# EAGLE design ATX12V_MAIN_VERT (EAGLE 7.1.0)
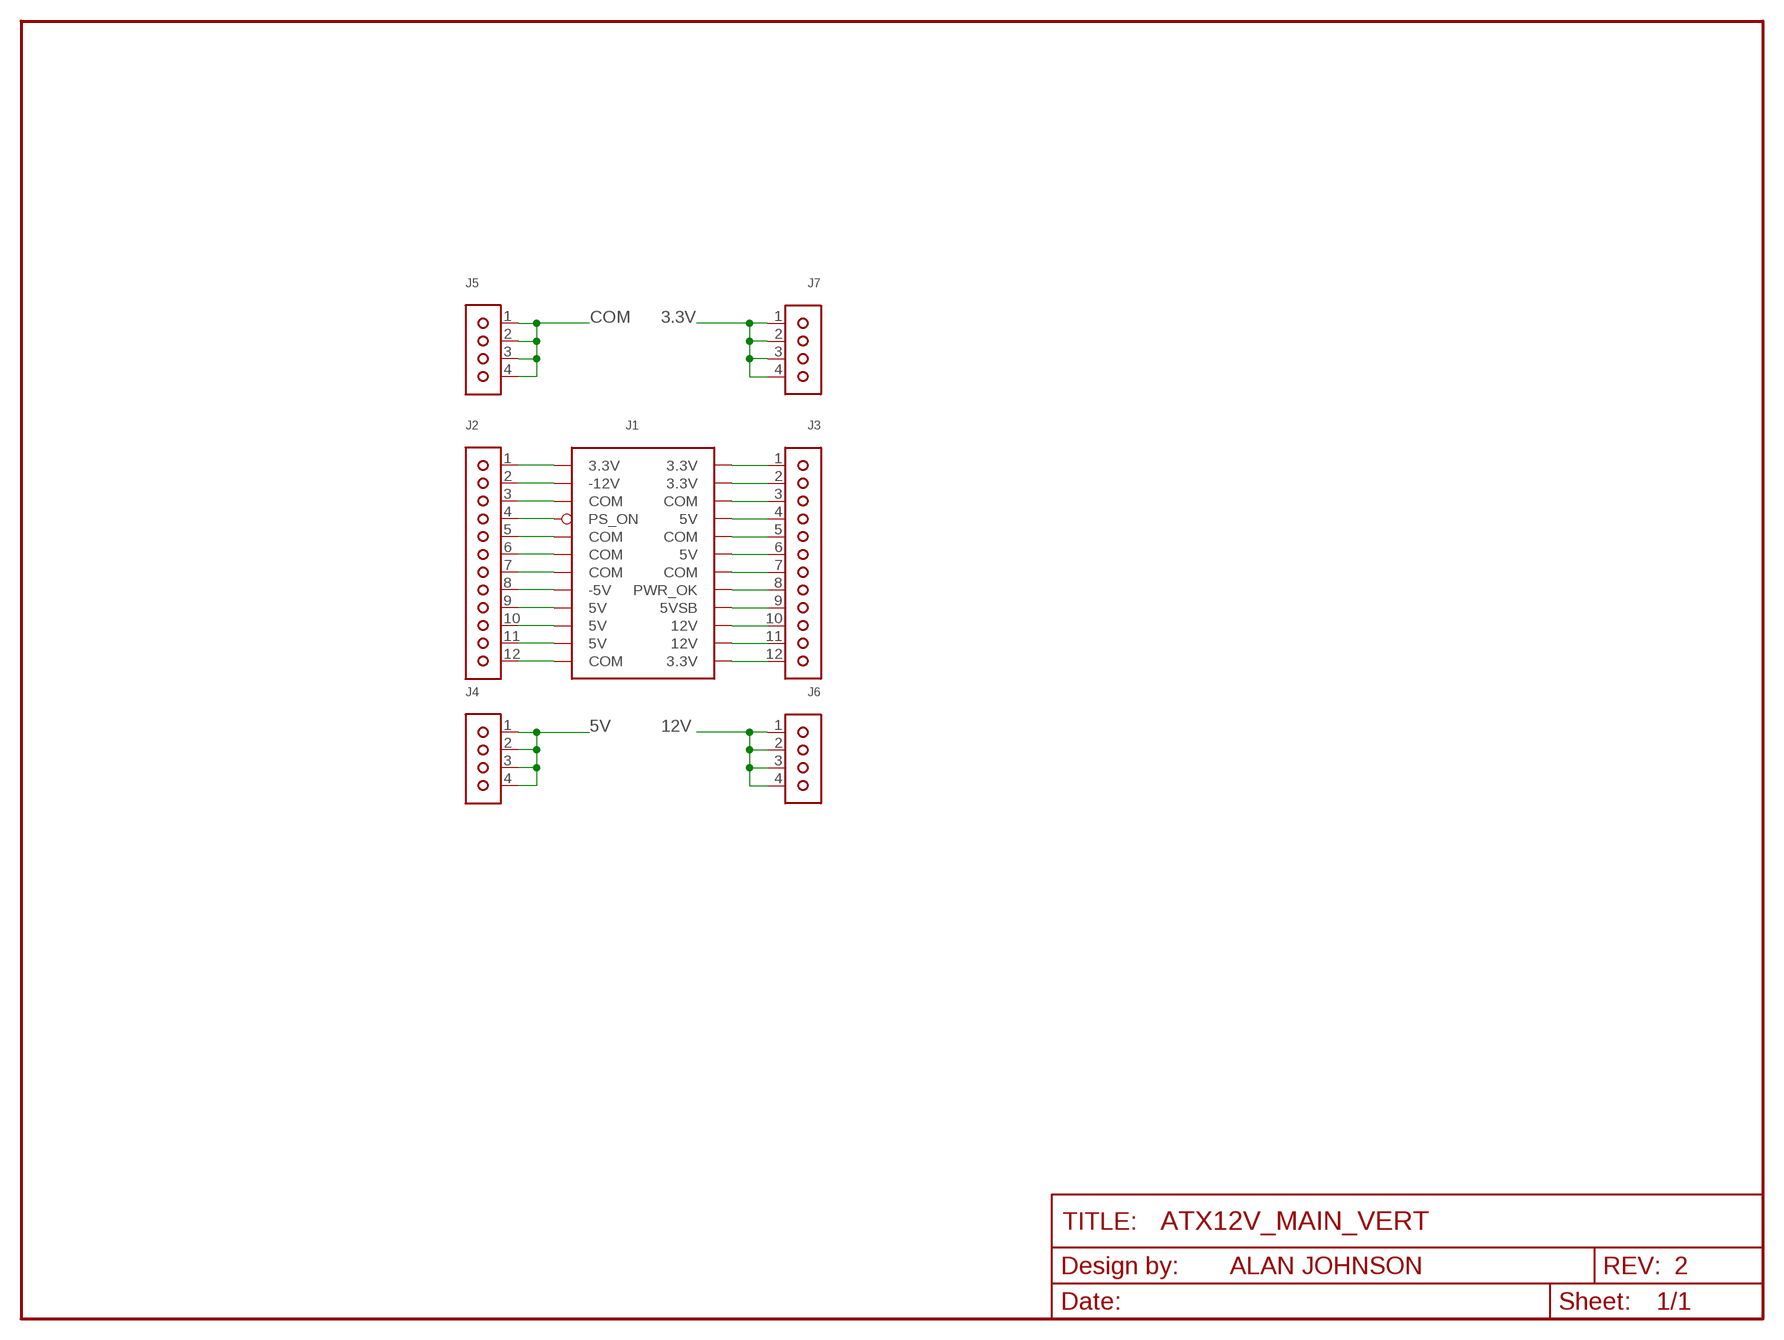
[diagram p0: schematic, sheet 1]

## Parts
J1  ATX12V_MAIN_VERT  [44206-0007]
J2  1X12  [1X12]
J3  1X12  [1X12]
J4  1X04  [1X04]
J5  1X04  [1X04]
J6  1X04  [1X04]
J7  1X04  [1X04]

## Nets
3.3V: J1.1(3.3V) J1.2(3.3V) J1.12(3.3V) J1.13(3.3V) J2.1 J3.1 J3.2 J3.12 J7.1 J7.2 J7.3 J7.4
5V: J1.4(5V) J1.6(5V) J1.21(5V) J1.22(5V) J1.23(5V) J2.9 J2.10 J2.11 J3.4 J3.6 J4.1 J4.2 J4.3 J4.4
5VSB: J1.9(5VSB) J3.9
12V: J1.10(12V) J1.11(12V) J3.10 J3.11 J6.1 J6.2 J6.3 J6.4
-5V: J1.20(-5V) J2.8
-12V: J1.14(-12V) J2.2
COM: J1.3(COM) J1.5(COM) J1.7(COM) J1.15(COM) J1.17(COM) J1.18(COM) J1.19(COM) J1.24(COM) J2.3 J2.5 J2.6 J2.7 J2.12 J3.3 J3.5 J3.7 J5.1 J5.2 J5.3 J5.4
PS_ON: J1.16(PS_ON) J2.4
PWR_OK: J1.8(PWR_OK) J3.8

## Notes on the sheet
- ALAN JOHNSON | 2

## Library data of the parts
J1 = breakouts:ATX12V_MAIN: ATX12V Main Connector
J2 J3 = breakouts:1X12: 1x12 Pin Headers
J4-J7 = breakouts:1X04: 1x04 Pin Headers

## Board
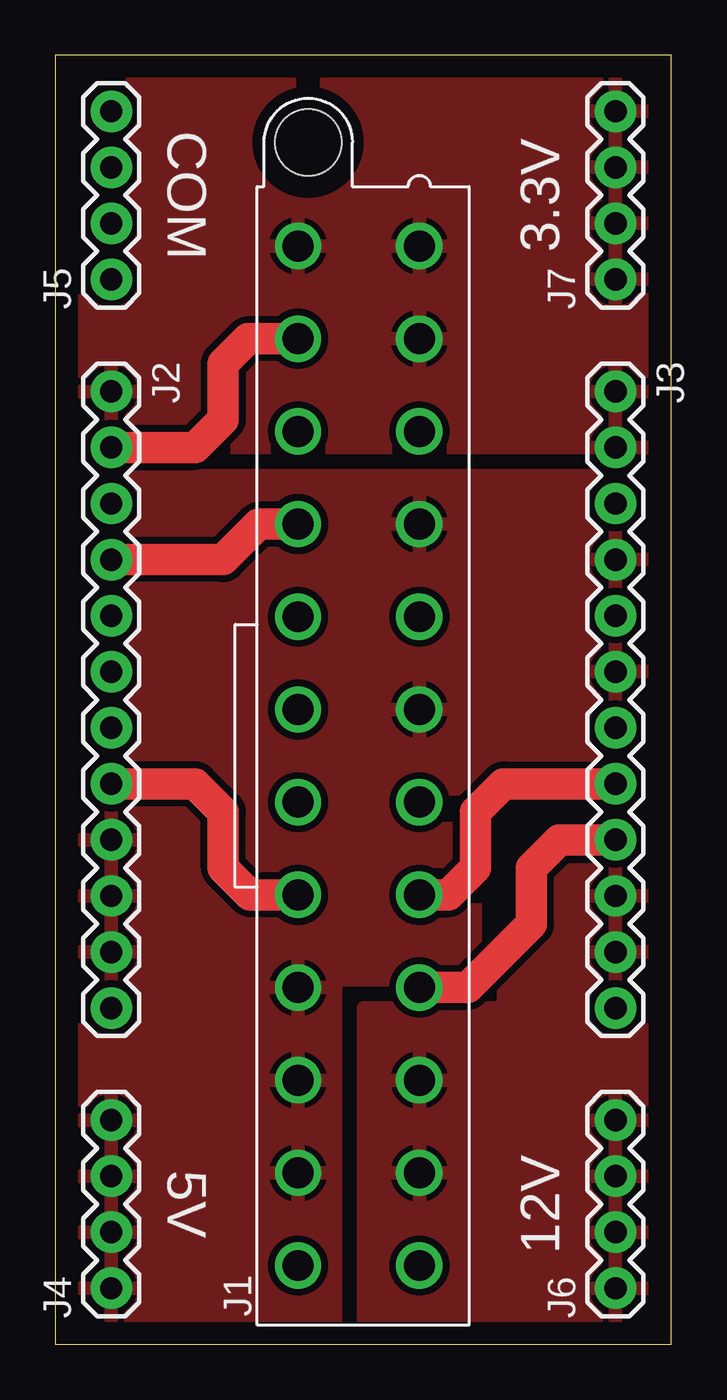
[diagram p1: board, top side]
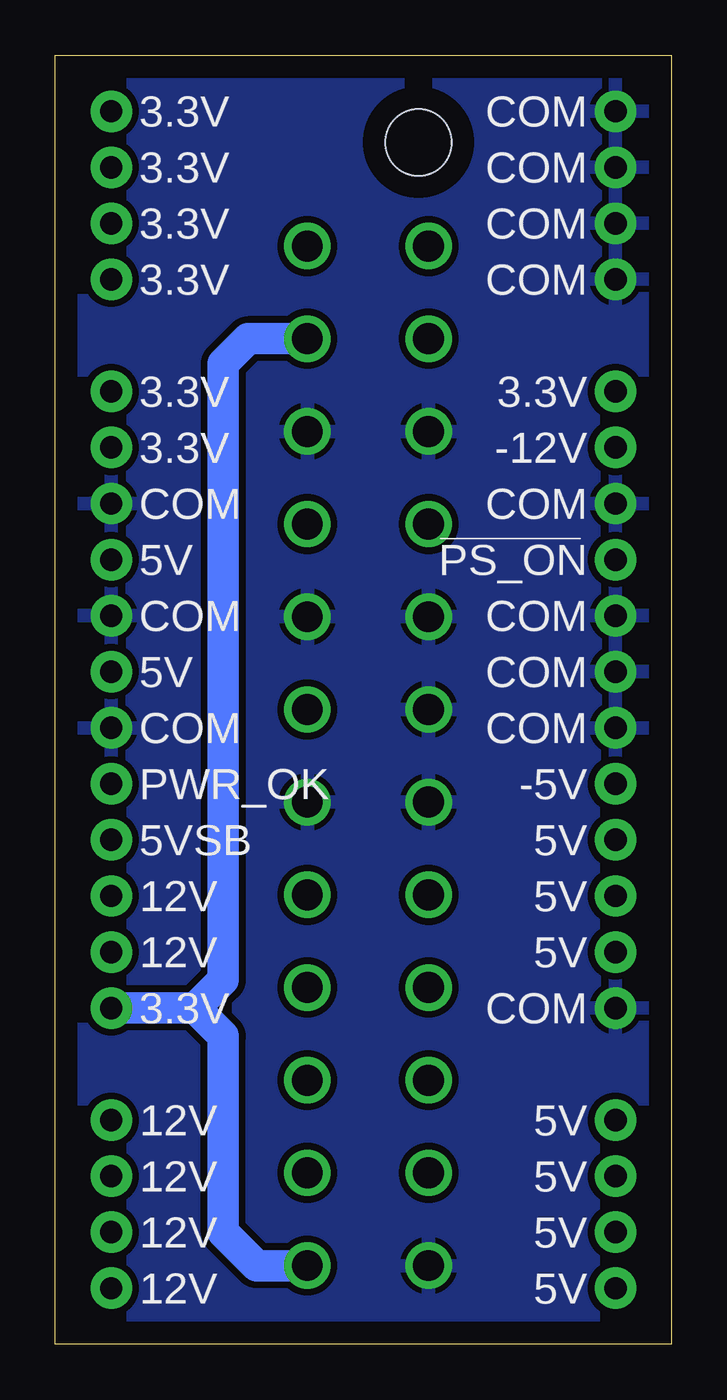
[diagram p2: board, bottom side, seen from below]

Size 27.94 x 58.42 mm. Coordinates in mm from the lower left corner, seen from the top.
Outline: 0,0 27.94,0 27.94,58.42 0,58.42 0,0
Copper layers (1*16): Top 0.035mm / dielectric 1.5mm / Bottom 0.035mm
Design rules "default": minimum track width 10mil, minimum drill 24mil, track to track 8mil, track to pad 8mil, pad to pad 8mil, via to via 8mil, smd to smd 8mil, copper to edge 40mil, drill to drill 8mil, minimum pad ring 10mil, minimum via ring 8mil, stop-mask expansion 4mil, vias tented up to drill 0mil, thermal gap 10mil

### Footprints (pad centres in the part's own frame; a part is rotated, then mirrored left to right if it is on the bottom)
44206-0007 = drill 1.4: 1 23.1,0; 2 18.9,0; 3 14.7,0; 4 10.5,0; 5 6.3,0; 6 2.1,0; 7 -2.1,0; 8 -6.3,0; 9 -10.5,0; 10 -14.7,0; 11 -18.9,0; 12 -23.1,0; 13 23.1,5.5; 14 18.9,5.5; 15 14.7,5.5; 16 10.5,5.5; 17 6.3,5.5; 18 2.1,5.5; 19 -2.1,5.5; 20 -6.3,5.5; 21 -10.5,5.5; 22 -14.7,5.5; 23 -18.9,5.5; 24 -23.1,5.5 | hole 3: 27.8,5.04
1X12 = drill 1.016 pad 1.88: 1 0,0; 2 2.54,0; 3 5.08,0; 4 7.62,0; 5 10.16,0; 6 12.7,0; 7 15.24,0; 8 17.78,0; 9 20.32,0; 10 22.86,0; 11 25.4,0; 12 27.94,0
1X04 = drill 1.016 pad 1.88: 1 0,0; 2 2.54,0; 3 5.08,0; 4 7.62,0

### Placement (x,y rotation side)
J1  16.51,26.67 90 top
J2  2.54,43.18 270 top
J3  25.4,43.18 270 top
J4  2.54,2.54 90 top
J5  2.54,48.26 90 top
J6  25.4,2.54 90 top
J7  25.4,48.26 90 top

### Tracks (layer width: path | path; a pad name or v marks a point on that pad's centre or on a via)
3.3V
  Bottom 1.422: J1.12 18.81,3.57 20.32,5.08 20.32,13.97 21.59,15.24 | 21.59,15.24 J3.12 | J1.2 19.2,45.57 20.32,44.45 20.32,16.51 21.59,15.24
  pour Top (isolate 0.305): 0,58.42 27.94,58.42 27.94,40.64 0,40.64
5V
  pour Top (isolate 0.305): 0,0 12.7,0 12.7,16.51 19.05,16.51 19.05,22.86 27.94,22.86 27.94,39.37 0,39.37
5VSB
  Top 1.422: J1.9 18.71,16.17 21.59,19.05 21.59,21.59 22.86,22.86 J3.9
12V
  pour Top (isolate 0.305): 13.97,0 27.94,0 27.94,21.59 20.32,21.59 20.32,15.24 13.97,15.24
-5V
  Top 1.422: J1.20 8.84,20.37 7.62,21.59 7.62,24.13 6.35,25.4 J2.8
-12V
  Top 1.422: J1.14 8.74,45.57 7.62,44.45 7.62,41.91 6.35,40.64 J2.2
COM
  pour Bottom (isolate 0.305): 0,0 27.94,0 27.94,58.42 0,58.42
PS_ON
  Top 1.422: J1.16 9.23,37.17 7.62,35.56 J2.4
PWR_OK
  Top 1.422: J1.8 17.83,20.37 19.05,21.59 19.05,24.13 20.32,25.4 J3.8

### Text on the board
tPlace: COM | 3.3V | 5V | 12V
bPlace: COM | 3.3V | COM | 3.3V | COM | 3.3V | COM | 3.3V | 3.3V | 3.3V | -12V | 3.3V | COM | COM | PS_ON | 5V | COM | COM | COM | 5V | COM | COM | -5V | PWR_OK | 5V | 5VSB | 5V | 12V | 5V | 12V | COM | 3.3V | 5V | 12V | 5V | 12V | 5V | 12V | 5V | 12V